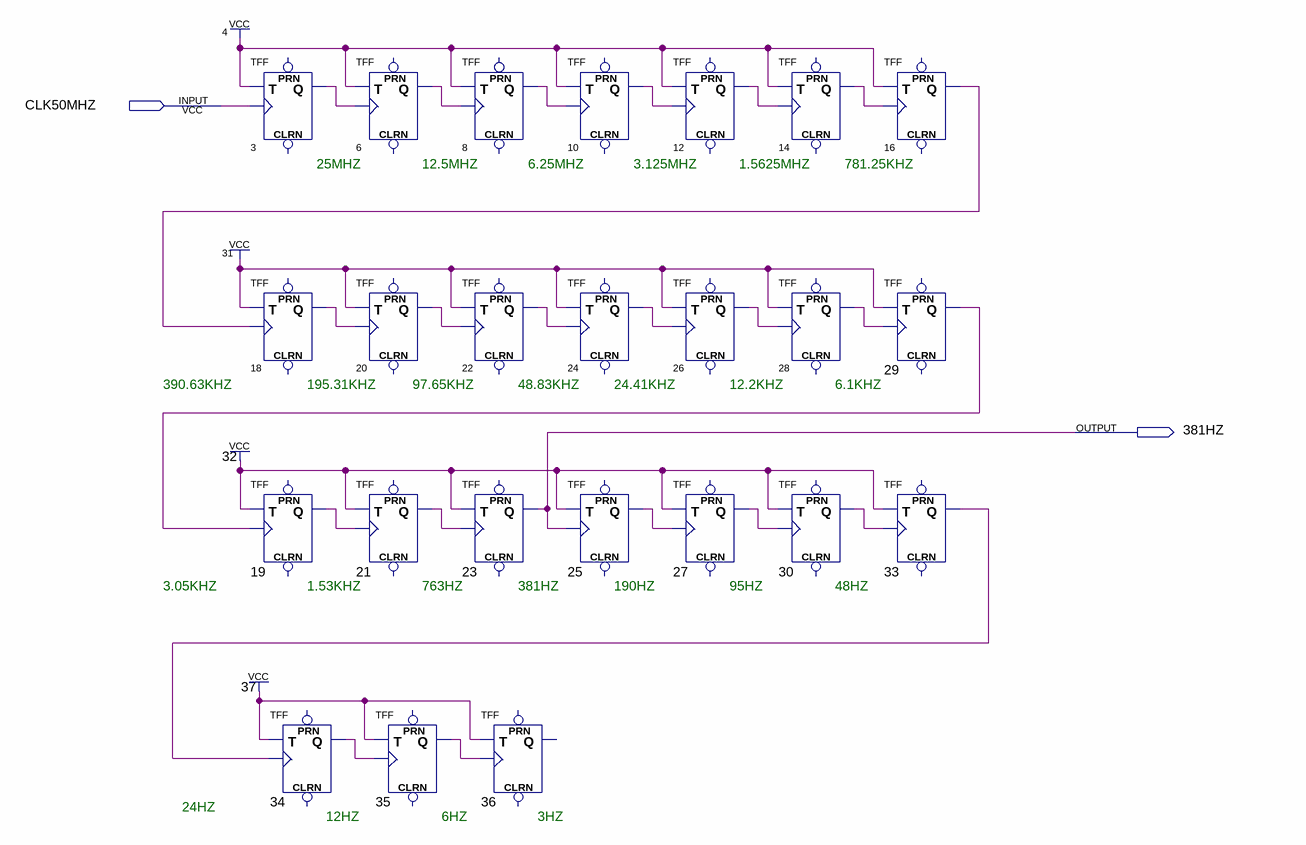
[diagram p0: schematic sheet]
// Quartus schematic normal.bdf as structural Verilog: 24 symbols, 2 pins
module normal (
  input  CLK50MHZ,
  output \381HZ 
);

  wire n3_q, n6_q, n8_q, n10_q, n12_q, n14_q, n16_q, n18_q, n19_q, n20_q, n21_q, n22_q, n24_q, n25_q, n26_q,
       n27_q, n28_q, n29_q, n30_q, n33_q, n34_q, n35_q;

  TFF u_3 (.T(1'b1), .CLK(CLK50MHZ), .Q(n3_q));  // open: PRN, CLRN
  TFF u_18 (.T(1'b1), .CLK(n16_q), .Q(n18_q));  // open: PRN, CLRN
  TFF u_19 (.T(1'b1), .CLK(n29_q), .Q(n19_q));  // open: PRN, CLRN
  TFF u_34 (.T(1'b1), .CLK(n33_q), .Q(n34_q));  // open: PRN, CLRN
  TFF u_6 (.T(1'b1), .CLK(n3_q), .Q(n6_q));  // open: PRN, CLRN
  TFF u_20 (.T(1'b1), .CLK(n18_q), .Q(n20_q));  // open: PRN, CLRN
  TFF u_21 (.T(1'b1), .CLK(n19_q), .Q(n21_q));  // open: PRN, CLRN
  TFF u_35 (.T(1'b1), .CLK(n34_q), .Q(n35_q));  // open: PRN, CLRN
  TFF u_8 (.T(1'b1), .CLK(n6_q), .Q(n8_q));  // open: PRN, CLRN
  TFF u_22 (.T(1'b1), .CLK(n20_q), .Q(n22_q));  // open: PRN, CLRN
  TFF u_23 (.T(1'b1), .CLK(n21_q), .Q(\381HZ ));  // open: PRN, CLRN
  TFF u_36 (.T(1'b1), .CLK(n35_q));  // open: PRN, CLRN, Q
  TFF u_10 (.T(1'b1), .CLK(n8_q), .Q(n10_q));  // open: PRN, CLRN
  TFF u_24 (.T(1'b1), .CLK(n22_q), .Q(n24_q));  // open: PRN, CLRN
  TFF u_25 (.T(1'b1), .CLK(\381HZ ), .Q(n25_q));  // open: PRN, CLRN
  TFF u_12 (.T(1'b1), .CLK(n10_q), .Q(n12_q));  // open: PRN, CLRN
  TFF u_26 (.T(1'b1), .CLK(n24_q), .Q(n26_q));  // open: PRN, CLRN
  TFF u_27 (.T(1'b1), .CLK(n25_q), .Q(n27_q));  // open: PRN, CLRN
  TFF u_14 (.T(1'b1), .CLK(n12_q), .Q(n14_q));  // open: PRN, CLRN
  TFF u_28 (.T(1'b1), .CLK(n26_q), .Q(n28_q));  // open: PRN, CLRN
  TFF u_30 (.T(1'b1), .CLK(n27_q), .Q(n30_q));  // open: PRN, CLRN
  TFF u_16 (.T(1'b1), .CLK(n14_q), .Q(n16_q));  // open: PRN, CLRN
  TFF u_29 (.T(1'b1), .CLK(n28_q), .Q(n29_q));  // open: PRN, CLRN
  TFF u_33 (.T(1'b1), .CLK(n30_q), .Q(n33_q));  // open: PRN, CLRN

  // Notes on the sheet:
  //   25MHZ
  //   12.5MHZ
  //   6.25MHZ
  //   3.125MHZ
  //   1.5625MHZ
  //   781.25KHZ
  //   390.63KHZ
  //   195.31KHZ
  //   97.65KHZ
  //   48.83KHZ
  //   24.41KHZ
  //   12.2KHZ
  //   6.1KHZ
  //   3.05KHZ
  //   1.53KHZ
  //   763HZ
  //   381HZ
  //   190HZ
  //   95HZ
  //   48HZ
  //   24HZ
  //   12HZ
  //   6HZ
  //   3HZ
endmodule
